# EAGLE design blinkm_mk2_3535aa (EAGLE 9.2.2)
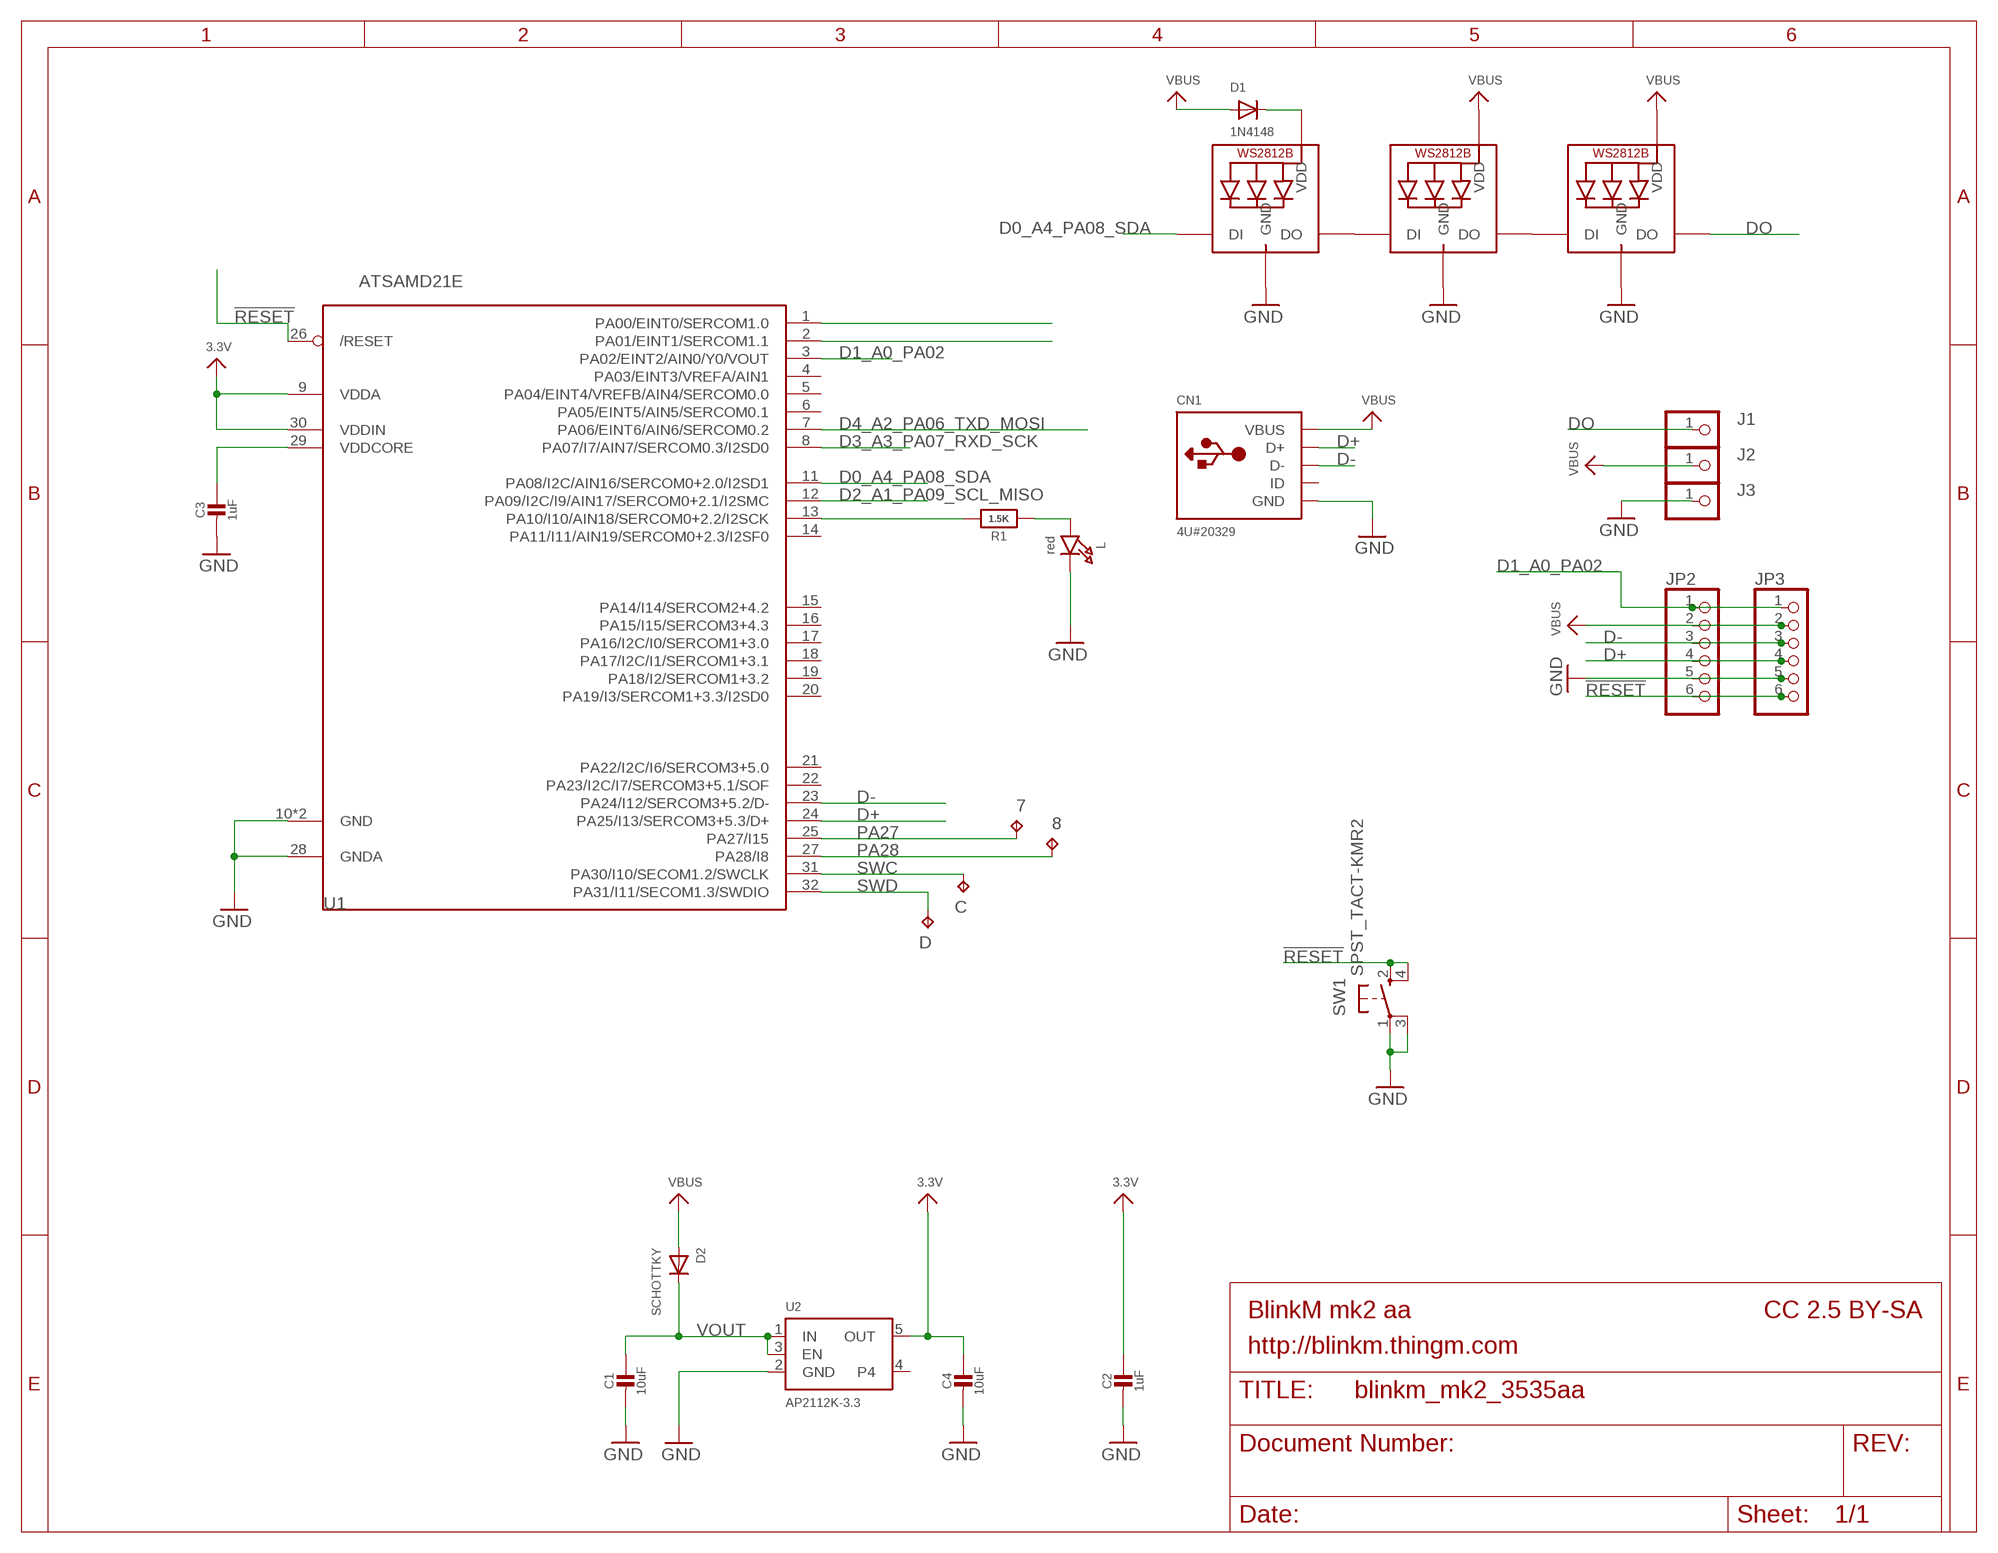
[diagram p0: schematic, sheet 1]

## Parts
7  TPTP15R  [TP15R]
8  TPTP15R  [TP15R]
C  TPTP15R  [TP15R]
C1  10uF  CAP_CERAMIC_0402  [_0402]
C2  1uF  CAP_CERAMIC_0402  [_0402]
C3  1uF  CAP_CERAMIC_0402  [_0402]
C4  10uF  CAP_CERAMIC_0402  [_0402]
CN1  4U#20329  USB_MICRO_20329_V2  [4UCONN_20329_V2]
D  TPTP15R  [TP15R]
D1  1N4148  DIODESOD-523  [SOD-523]
D2  SCHOTTKY  DIODESOD-523  [SOD-523]
J1  PINHD-1X1  [1X01]
J2  PINHD-1X1  [1X01]
J3  PINHD-1X1  [1X01]
JP2  PINHD-1X6  [1X06]
JP3  PINHD-1X6  [1X06]
L  red  LED0603_NOOUTLINE  [CHIPLED_0603_NOOUTLINE]
L1  WS2812B3535  [LED3535]
L2  WS2812B3535  [LED3535]
L3  WS2812B3535  [LED3535]
R1  1.5K  RESISTOR_0402  [_0402]
SW1  SPST_TACT-KMR2  [KMR2]
U1  ATSAMD21E  [QFN32_5MM]
U2  AP2112K-3.3  VREG_SOT23-5  [SOT23-5]

## Nets
3.3V: C2.1 C4.1 U1.9(VDDA) U1.30(VDDIN) U2.5(OUT)
!RESET: JP2.6 JP3.6 SW1.2(S) SW1.4(S1) U1.26(/RESET)
A3: U1.1(PA00/EINT0/SERCOM1.0)
D0_A4_PA08_SDA: L1.1(DI) U1.11(PA08/I2C/AIN16/SERCOM0+2.0/I2SD1)
D1_A0_PA02: JP2.1 JP3.1 U1.3(PA02/EINT2/AIN0/Y0/VOUT)
D2_A1_PA09_SCL_MISO: U1.12(PA09/I2C/I9/AIN17/SERCOM0+2.1/I2SMC)
D3_A3_PA07_RXD_SCK: U1.8(PA07/I7/AIN7/SERCOM0.3/I2SD0)
D4_A2_PA06_TXD_MOSI: U1.7(PA06/EINT6/AIN6/SERCOM0.2)
D+: CN1.D+ JP2.4 JP3.4 U1.24(PA25/I13/SERCOM3+5.3/D+)
D-: CN1.D- JP2.3 JP3.3 U1.23(PA24/I12/SERCOM3+5.2/D-)
DO: J1.1 L3.3(DO)
GND: C1.2 C2.2 C3.2 C4.2 CN1.BASE@1(GND) CN1.BASE@2(GND) CN1.GND CN1.SPRT@1(GND) CN1.SPRT@2(GND) CN1.SPRT@3(GND) CN1.SPRT@4(GND) J3.1 JP2.5 JP3.5 L1.4(GND) L2.4(GND) L3.4(GND) L.C SW1.1(P) SW1.3(P1) U1.10(GND) U1.28(GNDA) U1.33(GND) U2.2(GND)
N$1: L.A R1.1
N$2: R1.2 U1.13(PA10/I10/AIN18/SERCOM0+2.2/I2SCK)
N$3: L1.3(DO) L2.1(DI)
N$5: L2.3(DO) L3.1(DI)
N$7: D1.K(C) L1.2(VDD)
N$8: U1.2(PA01/EINT1/SERCOM1.1)
PA27: 7.TP U1.25(PA27/I15)
PA28: 8.TP U1.27(PA28/I8)
SWC: C.TP U1.31(PA30/I10/SECOM1.2/SWCLK)
SWD: D.TP U1.32(PA31/I11/SECOM1.3/SWDIO)
VBUS: CN1.VBUS D1.A D2.A J2.1 JP2.2 JP3.2 L2.2(VDD) L3.2(VDD)
VDDCORE: C3.1 U1.29(VDDCORE)
VOUT: C1.1 D2.K(C) U2.1(IN) U2.3(EN)
Unconnected: CN1.ID U1.4(PA03/EINT3/VREFA/AIN1) U1.5(PA04/EINT4/VREFB/AIN4/SERCOM0.0) U1.6(PA05/EINT5/AIN5/SERCOM0.1) U1.14(PA11/I11/AIN19/SERCOM0+2.3/I2SF0) U1.15(PA14/I14/SERCOM2+4.2) U1.16(PA15/I15/SERCOM3+4.3) U1.17(PA16/I2C/I0/SERCOM1+3.0) U1.18(PA17/I2C/I1/SERCOM1+3.1) U1.19(PA18/I2/SERCOM1+3.2) U1.20(PA19/I3/SERCOM1+3.3/I2SD0) U1.21(PA22/I2C/I6/SERCOM3+5.0) U1.22(PA23/I2C/I7/SERCOM3+5.1/SOF) U2.4

## Notes on the sheet
- BlinkM mk2 aa | CC 2.5 BY-SA
- http://blinkm.thingm.com

## Library data of the parts
7 8 C D = testpad:TP: Test pad
C1-C4 = microbuilder:CAP_CERAMIC: Ceramic Capacitors For new designs, use the packages preceded by an '_' character since they are more reliable: The following footprints should be used on most boards: _0402 - Standard footprint for regular board layouts _0603 - Standard footprint for regular board layouts _0805 - Standard footprint for regular board layouts _1206 - Standard footprint for regular board layouts For extremely tight-pitch boards where space is at a premium, the following 'micro-pitch' footprints can be used (smaller pads, no silkscreen outline, etc.): _0402MP - Micro-pitch footprint for very dense/compact boards _0603MP - Micro-pitch footprint for very dense/compact boards _0805MP - Micro-pitch footprint for very dense/compact boards _1206MP - Micro-pitch footprint for very dense/compact boards
CN1 = microbuilder:USB: USB Connectors USBMINIB - Surface Mount Female Mini-B USB Connector 4UConnector: 06564
D1 D2 = adafruit:DIODE: Diode SMADIODE - SMA Surface Mount Package 20V 1A Schottky Diode Digikey: 641-1014-6-ND DO-1N4148 - Through Hole Small Current Diode SOD-123 20V 1 A (.5mV Vf) Schottky Diode - Digikey: MBRX120TPMSCT-ND SOD-323 10V 570mA (.38mV Vf, 3ns) Schottky Diode - Digikey: ZLLS410CT-ND SOD-523 30V 30mA Schottky Diode (RB751S-40TE61) - Digikey: RB751S-40TE61CT-ND SOT23-R/W - SOT23 Package (R = Solder Paste/Reflow Ovens, W = Hand-Soldering) BAT54Film 40V 300mA - Digikey: 497-7162-1-ND
J1-J3 = adafruit:PINHD-1X1: Pin header 1x1 for 0.1" spacing With round pins
JP2 JP3 = adafruit:PINHD-1X6: PIN HEADER
L = microbuilder:LED: LED 0603 - 0603 Surface Mount Package 2mA: Green LED - Low Power (3.9mcd, 2ma, 1.7Vf) - Digikey: 475-2709-2-ND Orange LED - Low Power (9.8mcd, 2ma, 1.8Vf) - Digikey: 475-1194-2-ND Red LED - Low Power (5mcd, 2ma, 1.8Vf) - Digikey: 475-1195-2-ND Yellow LED - Low Power (7mcd, 2ma, 1.8Vf) - Digikey: 475-1196-2-ND 5mA: Blue LED - Low Power (17mcd, 5ma, 2.9Vf) - Digikey: LNJ937W8CRACT-ND 0805 - 0805 Surface Mount Package 2mA: Red LED (8.8mcd, 2mA, 1.8Vf, Clear) - Low Power [Digikey: 475-2510-1-ND] Green LED (5mcd, 2mA, 1.8Vf, Clear) - Low Power [Digikey: 475-2730-1-ND] Yellow LED (11.3mcd, 2mA, 1.8Vf, Clear) - Low Power [Digikey: 475-2555-1-ND] 20mA: Red LED (104mcd, 20mA, Diffused) - LS R976 [Digikey: 475-1278-6-ND] Red LED (12mcd, 20mA, 2.0Vf, Clear) - APT2012EC [Digikey: 754-1128-1-ND] Green LED (15mcd, 20mA, 2.2Vf, Clear) - APT2012GC [Digikey: 754-1131-1-ND] Orange LED (160mcd, 20mA, 2.1Vf, Clear) - APT2012SECK [Digikey: 754-1130-1-ND] 1206 - 1206 Surface Mount Package Green LED (26mcd, 20mA, Diffused) - LG N971 [Digikey: 475-1407-6-ND] Red LED (15mcd, 20mA, Diffused) - LH N974 [Digikey: 475-1416-6-ND] Cree - Cree High-Power Surface Mount LEDs XPEBWT-L1-0000-00D50 - White 111lm 350mA 2.9Vf 6200K 110° XTEAWT-00-0000-00000LEE3 - White 114lm 350mA 2.85Vf 5000K 115° Everlight - Everlight 45-21 Series Surface Mount LEDs 45-21/QK2C-B2832AC2CB2/2T - Warm White 2000mcd 20mA 3.25Vf 3050K 120° 45-21/LK2C-B38452C4CB2/2T - Nuetral White 2000mcd 20mA 3.25Vf 4150K 120° 45-21/LK2C-B50634C6CB2/2T - Cold White 2200mcd 20mA 3.25Vf 5650K 120° PLCC2 Reverse Mount LS T77K-J1L2-1-0-2-R18-Z - Red 11.25mcd 2mA 1.8Vf 630nm 120° LO T77K-L1M2-24-Z - Orange 19.6mcd 2mA 1.8Vf 606nm 120° LY T77K-K2M1-26-Z - Yellow 15.7mcd 2mA 1.8Vf 587nm 120°
L1-L3 = todstuff:WS2812B
R1 = microbuilder:RESISTOR: Resistors For new designs, use the packages preceded by an '_' character since they are more reliable: The following footprints should be used on most boards: _0402 - Standard footprint for regular board layouts _0603 - Standard footprint for regular board layouts _0805 - Standard footprint for regular board layouts _1206 - Standard footprint for regular board layouts For extremely tight-pitch boards where space is at a premium, the following 'micro-pitch' footprints can be used (smaller pads, no silkscreen outline, etc.): _0402MP - Micro-pitch footprint for very dense/compact boards _0603MP - Micro-pitch footprint for very dense/compact boards _0805MP - Micro-pitch footprint for very dense/compact boards _1206MP - Micro-pitch footprint for very dense/compact boards
SW1 = adafruit:SPST_TACT: SMT 6mm switch, EVQQ2 series http://www.ladyada.net/library/eagle
U1 = microbuilder:ATSAMD21E
U2 = microbuilder:VREG_SOT23-5: SOT23-5 Fixed Voltage Regulators Part Current Out V Out V In V Dropout θJA (°C/W) TJ (°C) Digikey Part No. ADP121 150mA 3.3V 3.4-5.5V 0.09V @ 150mA -- -- ADP121-AUJZ33R7CT-ND ADP121 150mA 3.0V 3.1-5.5V 0.09V @ 150mA -- -- ADP121-AUJZ30R7CT-ND ADP122 300mA 3.3V 3.4-5.5V 0.085V @ 300mA -- -- ADP122AUJZ-3.3-R7CT-ND ADP1712 300mA 3.3V 3.5-5.5V 0.17V @ 300mA -- -- ADP1712AUJZ-3.3-R7TR-ND AP7311 (Low Cost) 150mA 3.3V 3.5-6V 0.15V @ 150mA -- -- AP7311-33WG-7DICT-ND LD39015M18R 150mA 1.8V 1.9V-5.5V 0.08V @ 100mA -- -- 497-6977-1-ND LP2985A-33DBVR 150mA 3.3V 3.3-16V 0.28V @ 150mA 206 150 296-18479-1-ND MCP1824T-3302E/OT 300mA 3.3V 3.5V-6V 0.2V @ 300mA -- -- MCP1824T-3302E/OTCT-ND MIC5205-2.5YM5 TR 150mA 2.5V 2.7-16V 0.165V @ 150mA -- -- 576-1257-2-ND MIC5205-3.0YM5 TR 150mA 3.0V 3.2V-16V 0.165V @ 150mA -- -- 576-1258-2-ND MIC5205-3.3YM5 TR 150mA 3.3V 3.5V-16V 0.165V @ 150mA -- -- 576-1259-2-ND TPS780330220 150mA 3.3V+2.2V 3.6-5.5V 250mV Max -- -- 296-23332-1-ND TDA3663/N1,135 100mA 3.3V 3.5-45V 0.18V @ 50mA -- -- 568-5343-1-ND Max operating temp can be calculated using θJA, TJ (max junction temperature), and power in watts. Set the "Maximum Ambient Temperature" until it reaches TJ ("Max Junction Temperature"), which is the absolute limit for safe use of the regulator: Heat Sink Temperature Calculator <http://www.daycounter.com/Calculators/Heat-Sink-Temperature-Calculator.phtml> For example, With 12V source into a 3.3V LP2985 and a 30mA load, we are dissipating (12V-3.3V) * 0.03A = 0.261W. With a θJA of 206 °C/W, a TJ of 150°C, and 261mW we can safely use the chip without a heat sink up to 75°C (=147.1°C Junction Temperature).

## Board
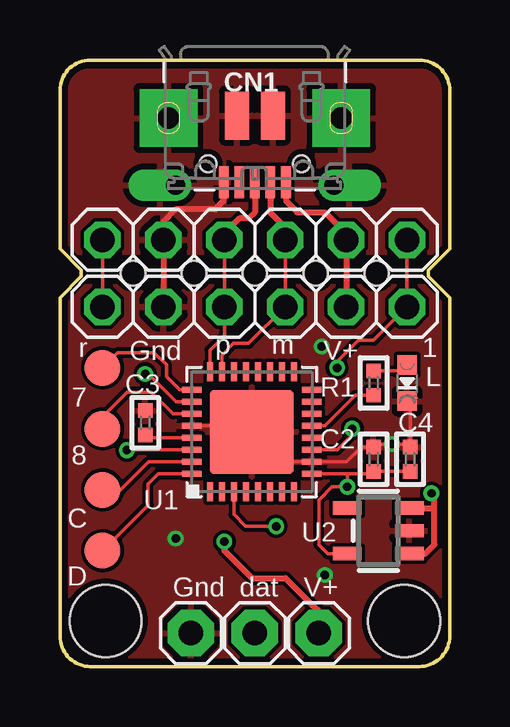
[diagram p1: board, top side]
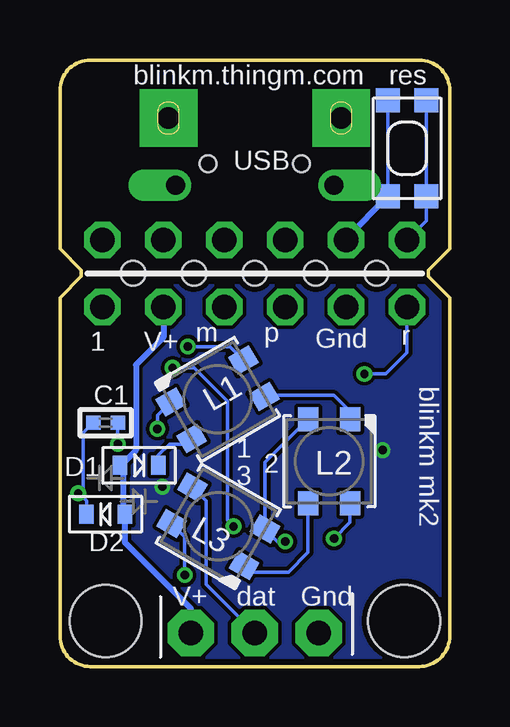
[diagram p2: board, bottom side, seen from below]

Size 16.26 x 25.27 mm. Coordinates in mm from the lower left corner, seen from the top.
Outline: 0,1.27 0,15.37 0.89,16.26 0.89,16.51 0,17.4 0,24 arc-90 1.27,25.27 14.99,25.27 arc-90 16.26,24 16.26,17.4 15.37,16.51 15.37,16.26 16.26,15.37 16.26,1.27 arc-90 14.99,0 1.27,0 arc-90 0,1.27
Copper layers (1*16): Top 0.035mm / dielectric 0.785mm / Bottom 0.035mm
Design rules "SeeedStudio_2layer_DRU_no_angle_20140221_blink1thin": minimum track width 6mil, minimum drill 12mil, track to track 6mil, track to pad 6mil, pad to pad 6mil, via to via 6mil, smd to smd 0mil, copper to edge 10mil, drill to drill 10mil, minimum pad ring 10mil, minimum via ring 6mil, stop-mask expansion 2mil, vias tented up to drill 100mil, thermal gap 10mil
Holes 3 mm at 1.91,1.91 14.35,1.91
Holes 1.02 mm at 3.05,16.38 5.59,16.38 8.13,16.38 10.67,16.38 13.21,16.38

### Footprints (pad centres in the part's own frame; a part is rotated, then mirrored left to right if it is on the bottom)
TP15R = smd 1.5 x 1.5: TP 0,0
_0402 = smd 0.6 x 0.6: 1 -0.508,0; 2 0.508,0
4UCONN_20329_V2 = smd 1 x 2: BASE@1 -0.75,-2; BASE@2 0.75,-2 | smd 0.4 x 1.35: D+ 0,0.775; D- -0.65,0.775; GND 1.3,0.775; ID 0.65,0.775; VBUS -1.3,0.775 | drill 0.8 pad 1.143 offset: SPRT@1 -3.3,0.9; SPRT@2 3.3,0.9 | drill 0.9 pad 2.413 square: SPRT@3 -3.6,-1.9; SPRT@4 3.6,-1.9 | hole 0.7: -1.95,0; 1.95,0
SOD-523 = smd 0.8 x 0.6: A 0,-0.8; K 0,0.8
1X01 = drill 1.016 pad 1.93 octagon: 1 0,0
1X06 = drill 1.016 octagon: 1 -6.35,0; 2 -3.81,0; 3 -1.27,0; 4 1.27,0; 5 3.81,0; 6 6.35,0
CHIPLED_0603_NOOUTLINE = smd 0.8 x 0.8: A 0,-0.75; C 0,0.75
LED3535 = smd 1 x 0.85: 1 -1.75,0.875; 2 -1.75,-0.875; 3 1.75,-0.875; 4 1.75,0.875
KMR2 = smd 1 x 1: 1 2,0.8; 2 2,-0.8; 3 -2,0.8; 4 -2,-0.8
QFN32_5MM = smd 0.8 x 0.25: 1 -2.5,1.75; 2 -2.5,1.25; 3 -2.5,0.75; 4 -2.5,0.25; 5 -2.5,-0.25; 6 -2.5,-0.75; 7 -2.5,-1.25; 8 -2.5,-1.75; 17 2.5,-1.75; 18 2.5,-1.25; 19 2.5,-0.75; 20 2.5,-0.25; 21 2.5,0.25; 22 2.5,0.75; 23 2.5,1.25; 24 2.5,1.75 | smd 0.25 x 0.8: 9 -1.75,-2.5; 10 -1.25,-2.5; 11 -0.75,-2.5; 12 -0.25,-2.5; 13 0.25,-2.5; 14 0.75,-2.5; 15 1.25,-2.5; 16 1.75,-2.5; 25 1.75,2.5; 26 1.25,2.5; 27 0.75,2.5; 28 0.25,2.5; 29 -0.25,2.5; 30 -0.75,2.5; 31 -1.25,2.5; 32 -1.75,2.5 | smd 3.5 x 3.5: 33 0,0
SOT23-5 = smd 0.55 x 1.2: 1 -0.95,-1.3; 2 0,-1.3; 3 0.95,-1.3; 4 0.95,1.3; 5 -0.95,1.3

### Placement (x,y rotation side)
7  1.78,12.45 270 top
8  1.78,9.91 270 top
C  1.78,7.37 90 top
C1  14.35,10.16 0 bottom
C2  13.08,8.64 90 top
C3  3.56,10.16 90 top
C4  14.61,8.64 90 top
CN1  8.13,20.95 180 top
D  1.78,4.83 90 top
D1  12.95,8.38 270 bottom
D2  14.35,6.35 90 bottom
J1  8.13,1.4 0 top
J2  10.79,1.4 0 top
J3  5.46,1.4 0 top
JP2  8.13,14.99 180 top
JP3  8.13,17.78 180 top
L  14.48,11.81 180 top
L1  9.68,11.14 30 bottom
L2  5.03,8.55 270 bottom
L3  9.65,5.84 150 bottom
R1  13.08,11.81 270 top
SW1  1.78,21.59 90 bottom
U1  8,9.78 90 top
U2  13.28,5.66 90 top

### Tracks (layer width: path | path; a pad name or v marks a point on that pad's centre or on a via)
3.3V  (via drill 0.35)
  Top 0.152: U1.9 12.06,8.03 | 12.06,8.03 12.98,8.03 C2.1 C4.1 | U1.30 v2.81,9.03 v2.79,9.02 | U2.5 11.18,4.71 11.18,4.7 10.79,5.08 10.79,6.94 11.35,7.49 v11.99,7.49 11.99,7.95 12.06,8.03
  pour Bottom: 16.89,15.88 -0.38,15.88 -0.38,-0.51 16.89,-0.51
!RESET  (via drill 0.35)
  Top 0.152: v3.56,12.19 3.68,12.19 4.85,11.03 U1.26 | JP3.6 JP2.6
  Bottom 0.152: JP2.6 1.78,13.08 2.67,12.19 v3.56,12.19 | SW1.2 SW1.4 0.98,18.58 JP3.6
D0_A4_PA08_SDA  (via drill 0.35)
  Top 0.152: U1.11 11.57,9.03 12.19,9.65 v12.19,9.91
  Bottom 0.152: L1.1 12.19,10.46 v12.19,9.91
D1_A0_PA02  (via drill 0.35)
  Top 0.152: U1.3 7.25,6.34 7.75,5.84 v9.02,5.84 | JP3.1 JP2.1 13.08,13.59 12.45,13.59 11.56,12.7 v11.56,12.45
  Bottom 0.152: v9.02,5.84 9.27,6.1 9.27,11.05 10.67,12.45 v11.56,12.45
D+
  Top 0.152: U1.24 6.25,13.18 6.86,13.79 JP2.4 JP3.4
  Top 0.254: CN1.D+ 8.13,18.92 7.87,18.67 7.49,18.67 6.86,18.03 JP3.4
D-
  Top 0.152: U1.23 6.75,12.97 7.24,13.46 7.87,13.46 JP2.3 JP3.3
  Top 0.254: CN1.D- 8.78,18.91 9.4,18.29 JP3.3
DO
  Bottom 0.152: J1.1 10.16,3.43 10.16,6.91 L3.3
GND  (via drill 0.35)
  Top 0.152: U1.28 8,10.03 U1.33 8,8.53 U1.10 11.96,8.53 12.57,9.14 C2.2 13.21,9.27 v13.84,9.27 14.48,9.27 C4.2 14.61,10.93 L.C
  Top 0.254: CN1.GND 6.83,19.4 6.48,19.05 4.83,19.05 4.32,18.54 JP3.5 JP2.5
  Bottom 0.152: SW1.1 SW1.3 | v4.83,5.33 4.16,6.01 L2.4 | L3.4 11.05,5.4 v11.05,3.81 | L1.4 9.17,13.34 v10.92,13.34 | C1.2 v13.84,9.27
  Bottom 0.254: SW1.3 4.32,17.85 JP3.5
  pour Top: 0,15.88 17.02,15.88 17.02,-0.25 0,-0.25
  pour Top: 0.13,25.53 16.38,25.53 16.38,17.27 0,17.27 0,25.53
N$1
  Top 0.152: R1.1 14.48,12.32 L.A
N$2
  Top 0.152: R1.2 12.32,11.3 11.04,10.03 U1.13
N$3
  Bottom 0.152: L2.1 4.16,10.63 4.83,11.3 7.68,11.3 L1.3
N$5
  Bottom 0.152: L2.3 5.91,4.76 6.73,3.94 8.3,3.94 L3.1
N$7
  Bottom 0.152: 10.89,9.63 L1.2 10.99,9.27 11.68,9.27 12.15,8.8 D1.K
PA27
  Top 0.152: U1.25 4.98,11.53 4.45,12.07 4.45,12.57 3.94,13.08 2.41,13.08 7.TP
PA28
  Top 0.152: U1.27 4.71,10.53 3.81,11.43 2.79,11.43 1.78,10.41 8.TP
SWC
  Top 0.152: U1.31 3.7,8.53 2.54,7.37 C.TP
SWD
  Top 0.152: U1.32 4.09,8.03 3.68,7.62 3.68,6.73 D.TP
VBUS  (via drill 0.35)
  Top 0.152: 10.79,2.41 J2.1
  Top 0.254: 9.43,19.91 CN1.VBUS 9.43,19.4 9.91,18.92 11.05,18.92 11.94,18.03 JP3.2 JP2.2 | v6.86,5.21 6.86,4.83 8,3.68 9.4,3.68 10.79,2.29 J2.1
  Bottom 0.152: L2.2 7.7,8.51 L3.2 7.18,5.21 v6.86,5.21 | 13.59,8.55 D1.A 13.73,8.36 13.63,8.26 | 13.63,6.43 D2.A
  Bottom 0.254: JP2.2 11.94,13.72 13.08,12.57 13.08,9.02 13.73,8.36 | D2.A 13.55,5.17 10.79,2.41 J2.1 | 13.63,8.26 13.63,6.43
VDDCORE
  Top 0.152: U1.29 3.68,9.53 C3.1
VOUT  (via drill 0.35)
  Top 0.152: 15.49,6.6 15.62,6.48 15.62,5.08 | 15.62,7.11 15.6,7.11 v15.49,7.22
  Top 0.254: U2.3 15.49,6.6 | U2.1 15.25,4.71 15.62,5.08 15.62,7.11
  Bottom 0.152: D2.K 15.11,6.39 | D2.K 15.28,6.48 | C1.1 15.28,9.74 15.28,7.44 v15.49,7.22 15.15,6.92 D2.K

### Text on the board
tPlace: r | Gnd | p | m | V+ | 1 | _3535aa | Gnd | dat | V+
bNames: res | blinkm.thingm.com | USB | r | Gnd | p | m | V+ | 1 | blinkm mk2 | 1 | 2 | 3 | Gnd | dat | V+